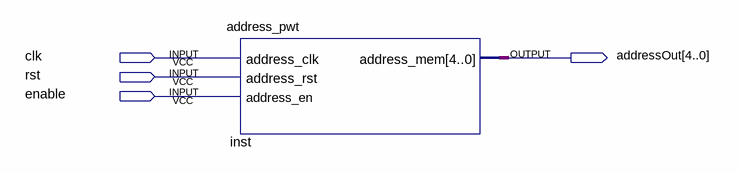
[diagram p0: schematic sheet]
// Quartus schematic address.bdf as structural Verilog: 1 symbols, 4 pins
module address (
  input  clk,
  input  rst,
  input  enable,
  output [4:0] addressOut
);

  address_pwt inst (.address_clk(clk), .address_rst(rst), .address_en(enable), .address_mem(addressOut));
endmodule
